# EAGLE schematic Micromouse_controller_v005 (EAGLE 7.2.0)
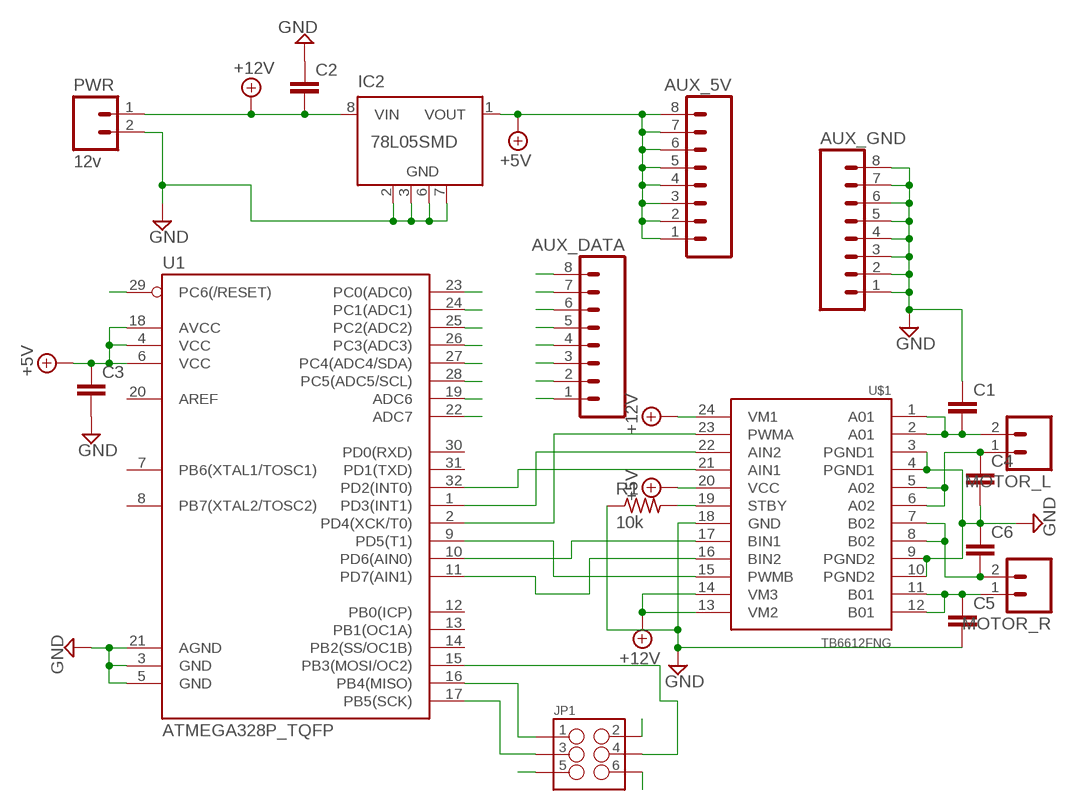
[diagram p0: schematic, sheet 1]

## Parts
AUX_5V  M08SMD-STRAIGHT-ALT-FEMALE  [1X08_SMD_ALT]
AUX_DATA  M08SMD-STRAIGHT-ALT-FEMALE  [1X08_SMD_ALT]
AUX_GND  M08SMD-STRAIGHT-ALT-FEMALE  [1X08_SMD_ALT]
C1  CAPSMD  [GRM43D]
C2  CAPSMD  [GRM43D]
C3  CAPSMD  [GRM43D]
C4  CAPSMD  [GRM43D]
C5  CAPSMD  [GRM43D]
C6  CAPSMD  [GRM43D]
IC2  78L05SMD  [SO08]
JP1  M03X2FEMALE_SMD  [2X3_SMD]
MOTOR_L  M02-JST-2MM-SMT  [JST-2-SMD]
MOTOR_R  M02-JST-2MM-SMT  [JST-2-SMD]
PWR  12v  M02-JST-2MM-SMT  [JST-2-SMD]
R1  10k  R-US_R0603  [R0603]
U1  ATMEGA328P_TQFP  [TQFP32-08]
U$1  TB6612FNG  [SSOP24]

## Nets
+5V: AUX_5V.1 AUX_5V.2 AUX_5V.3 AUX_5V.4 AUX_5V.5 AUX_5V.6 AUX_5V.7 AUX_5V.8 C3.A IC2.1(VOUT) JP1.2 U1.4(VCC) U1.6(VCC) U1.18(AVCC) U$1.20(VCC)
+12V: C2.C IC2.8(VIN) PWR.1 U$1.13(VM2) U$1.14(VM3) U$1.24(VM1)
ADC0: AUX_DATA.3 U1.23(PC0(ADC0))
ADC1: AUX_DATA.4 U1.24(PC1(ADC1))
ADC2: AUX_DATA.5 U1.25(PC2(ADC2))
ADC3: AUX_DATA.6 U1.26(PC3(ADC3))
ADC4: AUX_DATA.7 U1.27(PC4(ADC4/SDA))
ADC5: AUX_DATA.8 U1.28(PC5(ADC5/SCL))
ADC6: AUX_DATA.1 U1.19(ADC6)
ADC7: AUX_DATA.2 U1.22(ADC7)
AIN1_DRIVER: U1.32(PD2(INT0)) U$1.21(AIN1)
AIN2_DRIVER: U1.1(PD3(INT1)) U$1.22(AIN2)
BIN1_DRIVER: U1.10(PD6(AIN0)) U$1.17(BIN1)
BIN2_DRIVER: U1.11(PD7(AIN1)) U$1.16(BIN2)
GND: AUX_GND.1 AUX_GND.2 AUX_GND.3 AUX_GND.4 AUX_GND.5 AUX_GND.6 AUX_GND.7 AUX_GND.8 C1.A C2.A C3.C C4.C C5.C C6.A IC2.2(GND) IC2.3(GND) IC2.6(GND) IC2.7(GND) JP1.6 PWR.2 R1.1 U1.3(GND) U1.5(GND) U1.21(AGND) U$1.3(PGND1) U$1.4(PGND1) U$1.9(PGND2) U$1.10(PGND2) U$1.18(GND)
N$11: C1.C MOTOR_L.2 U$1.1(A01) U$1.2(A01)
N$12: C4.A MOTOR_L.1 U$1.5(A02) U$1.6(A02)
N$13: C5.A MOTOR_R.1 U$1.11(B01) U$1.12(B01)
N$14: C6.C MOTOR_R.2 U$1.7(B02) U$1.8(B02)
N$17: JP1.1 U1.16(PB4(MISO))
N$18: JP1.3 U1.17(PB5(SCK))
N$22: JP1.4 U1.15(PB3(MOSI/OC2))
PWMA_DRIVER: U1.2(PD4(XCK/T0)) U$1.23(PWMA)
PWMB_DRIVER: U1.9(PD5(T1)) U$1.15(PWMB)
RST: JP1.5 U1.29(PC6(/RESET))
STBY: R1.2 U$1.19(STBY)
Unconnected: IC2.4(NC) IC2.5(NC) U1.7(PB6(XTAL1/TOSC1)) U1.8(PB7(XTAL2/TOSC2)) U1.12(PB0(ICP)) U1.13(PB1(OC1A)) U1.14(PB2(SS/OC1B)) U1.20(AREF) U1.30(PD0(RXD)) U1.31(PD1(TXD))

## Library data of the parts
AUX_5V AUX_DATA AUX_GND = SparkFun-Connectors:M08: Header 8 Standard 8-pin 0.1" header. Use with straight break away headers (SKU : PRT-00116), right angle break away headers (PRT-00553), swiss pins (PRT-00743), machine pins (PRT-00117), and female headers (PRT-00115).; PROD_ID: CONN-10204
C1-C6 = SparkFun-Capacitors:CAP: Capacitor Standard 0603 ceramic capacitor, and 0.1" leaded capacitor.
IC2 = linear:78L*SMD: Positive VOLTAGE REGULATOR
JP1 = SparkFun-Connectors:M03X2: 2x3 .1" header. Shrouded, with keying- CONN-10681 SMT- CONN-11415 Pogo pins- HW-11044; PROD_ID: CONN-11290
MOTOR_L MOTOR_R PWR = SparkFun-Connectors:M02: Standard 2-pin 0.1" header. Use with - straight break away headers ( PRT-00116) - right angle break away headers (PRT-00553) - swiss pins (PRT-00743) - machine pins (PRT-00117) - female headers (PRT-00115) Molex polarized connector foot print use with: PRT-08233 with associated crimp pins and housings. 2.54_SCREWTERM for use with PRT-10571. 3.5mm Screw Terminal footprints for PRT-08084 5mm Screw Terminal footprints for use with PRT-08432; PROD_ID: CONN-11443
R1 = resistor:R-US_: RESISTOR, American symbol
U1 = SparkFun-DigitalIC:ATMEGA328P_TQFP; PROD_ID: IC-09069
U$1 = SparkFun-PowerIC:TB6612FNG: Toshiba 1A dual motor driver IC-09363; PROD_ID: IC-09363